# EAGLE design control_board-ATSAMD21 (EAGLE 8.3.1)
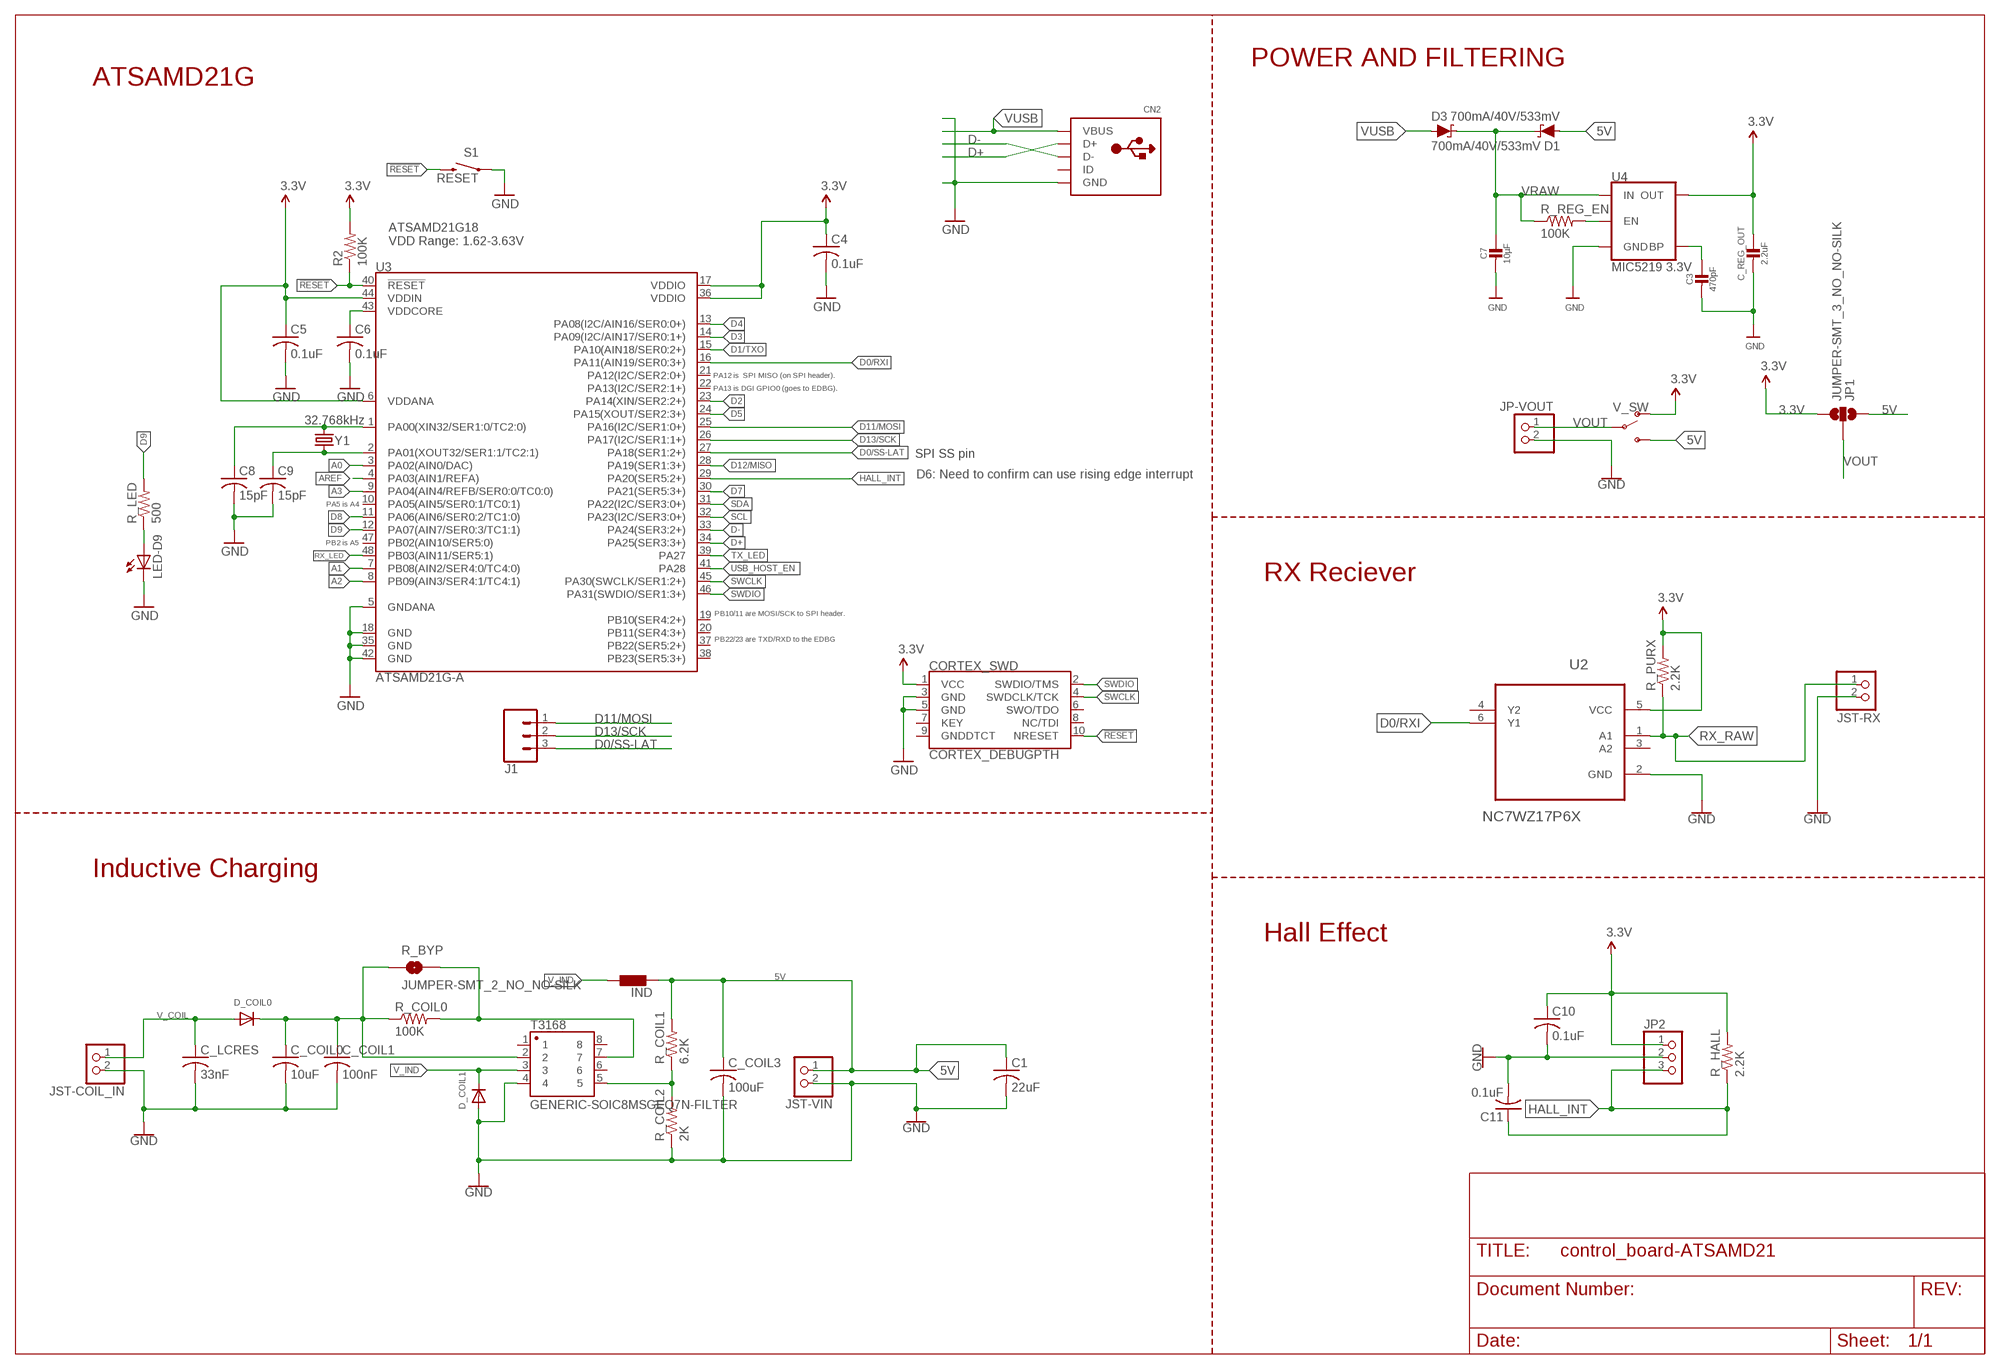
[diagram p0: schematic, sheet 1]

## Parts
C1  22uF  C-USC1206  [C1206]
C3  470pF  CAP_CERAMIC0603_NO  [0603-NO]
C4  0.1uF  C-USC0603  [C0603]
C5  0.1uF  C-USC0603  [C0603]
C6  0.1uF  C-USC0603  [C0603]
C7  10µF  CAP_CERAMIC0805-NOOUTLINE  [0805-NO]
C8  15pF  C-USC0603  [C0603]
C9  15pF  C-USC0603  [C0603]
C10  0.1uF  C-USC0603  [C0603]
C11  0.1uF  C-USC0603  [C0603]
C_COIL0  10uF  C-USC1206  [C1206]
C_COIL1  100nF  C-USC1206  [C1206]
C_COIL3  100uF  C-USC1206  [C1206]
C_LCRES  33nF  C-USC1206  [C1206]
C_REG_OUT  2.2uF  CAP_CERAMIC0805-NOOUTLINE  [0805-NO]
CN2  USBTHM  [USB-MINIB-THM]
CORTEX_SWD  CORTEX_DEBUGPTH  [2X5-PTH-1.27MM]
D1  700mA/40V/533mV  DIODE-SCHOTTKY-ZLLS500  [SOT23-3]
D3  700mA/40V/533mV  DIODE-SCHOTTKY-ZLLS500  [SOT23-3]
D_COIL0  DIODESMA  [SMADIODE]
D_COIL1  DIODE_SOD-123FL  [SOD-123FL]
IND  LL3230M  [L3230M]
J1  CONN_031X03_NO_SILK  [1X03_NO_SILK]
JP1  JUMPER-SMT_3_NO_NO-SILK  [SMT-JUMPER_3_NO_NO-SILK]
JP2  PINHD-1X3  [1X03]
JP-VOUT  PINHD-1X2  [1X02]
JST-COIL_IN  JST_2PIN-THM-RA  [JST-PH-2-THM-RA]
JST-RX  JST_2PIN-THM-RA  [JST-PH-2-THM-RA]
JST-VIN  JST_2PIN-THM-RA  [JST-PH-2-THM-RA]
LED-D9  LEDCHIPLED_0603  [CHIPLED_0603]
R2  100K  10KOHM-1/10W-1%(0603)0603  [0603-RES]
R_BYP  JUMPER-SMT_2_NO_NO-SILK  [SMT-JUMPER_2_NO_NO-SILK]
R_COIL0  100K  R-US_R0603  [R0603]
R_COIL1  6.2K  R-US_R0603  [R0603]
R_COIL2  2K  R-US_R0603  [R0603]
R_HALL  2.2K  R-US_R0805  [R0805]
R_LED  500  R-US_R0603  [R0603]
R_PURX  2.2K  R-US_R0603  [R0603]
R_REG_EN  100K  R-US_R0603  [R0603]
S1  RESET  SWITCH-MOMENTARY-2SMD-4.6X2.8MM  [TACTILE_SWITCH_SMD_4.6X2.8MM]
T3168  GENERIC-SOIC8MSGEQ7N-FILTER  [SO08]
U2  NC7WZ17P6X  [SOT65P210X110-6N]
U3  ATSAMD21G-A  [TQFP-48]
U4  MIC5219 3.3V  V_REG_MIC52193.3V  [SOT23-5]
V_SW  SWITCH-SPDT-SMD-RIGHT-ANGLE  [SWITCH_SPST_SMD_A]
Y1  32.768kHz  CRYSTAL3.2X1.5MM  [CRYSTAL-SMD-3.2X1.5MM]

## Nets
3.3V: C4.1 C5.1 C10.1 C_REG_OUT.1 CORTEX_SWD.1(VCC) JP1.3 JP2.1 R2.2 R_HALL.2 R_PURX.2 U2.5(VCC) U3.6(VDDANA) U3.17(VDDIO) U3.36(VDDIO) U3.44(VDDIN) U4.5(OUT) V_SW.1(O)
5V: C1.1 C_COIL3.1 D1.1(A) IND.2 JP1.1 JST-VIN.1 R_COIL1.2 V_SW.3(S)
!RESET: CORTEX_SWD.10(NRESET) R2.1 S1.3 S1.4 U3.40(!RESET!)
A0: U3.3(PA02(AIN0/DAC))
A1: U3.7(PB08(AIN2/SER4:0/TC4:0))
A2: U3.8(PB09(AIN3/SER4:1/TC4:1))
A3: U3.9(PA04(AIN4/REFB/SER0:0/TC0:0))
AREF: U3.4(PA03(AIN1/REFA))
D0/RXI: U2.6(Y1) U3.16(PA11(AIN19/SER0:3+))
D0/SS-LAT: J1.3 U3.27(PA18(SER1:2+))
D1/TXO: U3.15(PA10(AIN18/SER0:2+))
D2: U3.23(PA14(XIN/SER2:2+))
D3: U3.14(PA09(I2C/AIN17/SER0:1+))
D4: U3.13(PA08(I2C/AIN16/SER0:0+))
D5: U3.24(PA15(XOUT/SER2:3+))
D7: U3.30(PA21(SER5:3+))
D8: U3.11(PA06(AIN6/SER0:2/TC1:0))
D9: R_LED.2 U3.12(PA07(AIN7/SER0:3/TC1:1))
D11/MOSI: J1.1 U3.25(PA16(I2C/SER1:0+))
D12/MISO: U3.28(PA19(SER1:3+))
D13/SCK: J1.2 U3.26(PA17(I2C/SER1:1+))
D+: CN2.D+ U3.34(PA25(SER3:3+))
D-: CN2.D- U3.33(PA24(SER3:2+))
GND: C1.2 C3.2 C4.2 C5.2 C6.2 C7.2 C8.2 C9.2 C10.2 C11.2 C_COIL0.2 C_COIL1.2 C_COIL3.2 C_LCRES.2 C_REG_OUT.2 CN2.GND CORTEX_SWD.3(GND) CORTEX_SWD.5(GND) D_COIL1.A JP2.2 JP-VOUT.2 JST-COIL_IN.2 JST-RX.2 JST-VIN.2 LED-D9.C R_COIL2.1 S1.1 S1.2 T3168.4 U2.2(GND) U3.5(GNDANA) U3.18(GND) U3.35(GND) U3.42(GND) U4.2(GND)
HALL_INT: C11.1 JP2.3 R_HALL.1 U3.29(PA20(SER5:2+))
N$1: C_COIL0.1 C_COIL1.1 D_COIL0.C R_BYP.1 R_COIL0.1 T3168.2
N$2: C8.1 U3.1(PA00(XIN32/SER1:0/TC2:0)) Y1.P$2
N$3: R_COIL1.1 R_COIL2.2 T3168.5
N$4: C9.1 U3.2(PA01(XOUT32/SER1:1/TC2:1)) Y1.P$1
N$5: R_REG_EN.2 U4.3(EN)
N$6: C3.1 U4.4(BP)
N$7: R_BYP.2 R_COIL0.2 T3168.7
N$8: LED-D9.A R_LED.1
RX_LED: U3.48(PB03(AIN11/SER5:1))
RX_RAW: JST-RX.1 R_PURX.1 U2.1(A1)
SCL: U3.32(PA23(I2C/SER3:0+))
SDA: U3.31(PA22(I2C/SER3:0+))
SWCLK: CORTEX_SWD.4(SWDCLK/TCK) U3.45(PA30(SWCLK/SER1:2+))
SWDIO: CORTEX_SWD.2(SWDIO/TMS) U3.46(PA31(SWDIO/SER1:3+))
TX_LED: U3.39(PA27)
USB_HOST_EN: U3.41(PA28)
V_COIL: C_LCRES.1 D_COIL0.A JST-COIL_IN.1
V_IND: D_COIL1.C IND.1 T3168.3
VDDCORE: C6.1 U3.43(VDDCORE)
VOUT: JP1.2 JP-VOUT.1 V_SW.2(P)
VRAW: C7.1 D1.3(C) D3.3(C) R_REG_EN.1 U4.1(IN)
VUSB: CN2.VBUS D3.1(A)
Unconnected: CN2.ID CORTEX_SWD.6(SWO/TDO) CORTEX_SWD.7(KEY) CORTEX_SWD.8(NC/TDI) CORTEX_SWD.9(GNDDTCT) T3168.1 T3168.6 T3168.8 U2.3(A2) U2.4(Y2) U3.10(PA05(AIN5/SER0:1/TC0:1)) U3.19(PB10(SER4:2+)) U3.20(PB11(SER4:3+)) U3.21(PA12(I2C/SER2:0+)) U3.22(PA13(I2C/SER2:1+)) U3.37(PB22(SER5:2+)) U3.38(PB23(SER5:3+)) U3.47(PB02(AIN10/SER5:0))

## Notes on the sheet
- ATSAMD21G | POWER AND FILTERING
- ATSAMD21G18
  VDD Range: 1.62-3.63V
- PA12 is  SPI MISO (on SPI header).
- PA13 is DGI GPIO0 (goes to EDBG).
- SPI SS pin
- D6: Need to confirm can use rising edge interrupt
- PA5 is A4
- PB2 is A5
- RX Reciever
- PB10/11 are MOSI/SCK to SPI header.
- PB22/23 are TXD/RXD to the EDBG
- Inductive Charging
- Hall Effect

## Library data of the parts
C1 C4-C6 C8-C11 C_COIL0 C_COIL1 C_COIL3 C_LCRES = adafruit:C-US: CAPACITOR, American symbol
C3 C7 C_REG_OUT = microbuilder:CAP_CERAMIC: Ceramic Capacitors For new designs, use the packages preceded by an '_' character since they are more reliable: The following footprints should be used on most boards: _0402 - Standard footprint for regular board layouts _0603 - Standard footprint for regular board layouts _0805 - Standard footprint for regular board layouts _1206 - Standard footprint for regular board layouts For extremely tight-pitch boards where space is at a premium, the following 'micro-pitch' footprints can be used (smaller pads, no silkscreen outline, etc.): _0402MP - Micro-pitch footprint for very dense/compact boards _0603MP - Micro-pitch footprint for very dense/compact boards _0805MP - Micro-pitch footprint for very dense/compact boards _1206MP - Micro-pitch footprint for very dense/compact boards
CN2 = adafruit:USB: USB Connectors USBMINIB - Surface Mount Female Mini-B USB Connector 4UConnector: 06564 By microbuilder.eu Thru-hole RA Female Mini-B USB Connector 4UConnector: 18732 By ladyada.net
CORTEX_SWD = samd21-temp:CORTEX_DEBUG: Cortex Debug Connector Datasheet <http://infocenter.arm.com/help/topic/com.arm.doc.faqs/attached/13634/cortex_debug_connectors.pdf>
D1 D3 = SparkFun-DiscreteSemi:DIODE-SCHOTTKY: Schottky diode A Schottky diode is a semiconductor diode which has a low forward voltage drop and a very fast switching action.; PROD_ID: DIO-08411
D_COIL0 D_COIL1 = adafruit:DIODE: Diode SMADIODE - SMA Surface Mount Package 20V 1A Schottky Diode Digikey: 641-1014-6-ND DO-1N4148 - Through Hole Small Current Diode SOD-123 20V 1 A (.5mV Vf) Schottky Diode - Digikey: MBRX120TPMSCT-ND SOD-323 10V 570mA (.38mV Vf, 3ns) Schottky Diode - Digikey: ZLLS410CT-ND SOD-523 30V 30mA Schottky Diode (RB751S-40TE61) - Digikey: RB751S-40TE61CT-ND SOT23-R/W - SOT23 Package (R = Solder Paste/Reflow Ovens, W = Hand-Soldering) BAT54Film 40V 300mA - Digikey: 497-7162-1-ND
IND = eagle-ltspice:L: INDUCTOR, European symbol; SPICEMODEL: NONE; SPICEPREFIX: L
J1 = SparkFun-Connectors:CONN_03: Multi connection point. Often used as Generic Header-pin footprint for 0.1 inch spaced/style header connections On any of the 0.1 inch spaced packages, you can populate with these: Break Away Headers - Straight <https://www.sparkfun.com/products/116> (PRT-00116) Break Away Male Headers - Right Angle <https://www.sparkfun.com/products/553> (PRT-00553) Female Headers <https://www.sparkfun.com/products/115> (PRT-00115) Break Away Headers - Machine Pin <https://www.sparkfun.com/products/117> (PRT-00117) Break Away Female Headers - Swiss Machine Pin <https://www.sparkfun.com/products/743> (PRT-00743) Stackable Header - 3 Pin (Female, 0.1") <https://www.sparkfun.com/products/13875> (PRT-13875) For SCREWTERMINALS and SPRING TERMINALS visit here: Screw Terimnals on SparkFun.com <https://www.sparkfun.com/search/results?term=Screw+Terminals> (5mm/3.5mm/2.54mm spacing) This device is also useful as a general connection point to wire up your design to another part of your project. Our various solder wires solder well into these plated through hole pads. Hook-Up Wire - Assortment (Stranded, 22 AWG) <https://www.sparkfun.com/products/11375> (PRT-11375) Hook-Up Wire - Assortment (Solid Core, 22 AWG) <https://www.sparkfun.com/products/11367> (PRT-11367) View the entire wire category on our website here <https://www.sparkfun.com/categories/141> Special notes: Molex polarized connector foot print use with SKU : PRT-08232 with associated crimp pins and housings.
JP1 = SparkFun-Jumpers:JUMPER-SMT_3_NO: Normally open jumper This jumper has three pads in close proximity to each other. Apply solder to close the connection(s).
JP2 = pinhead:PINHD-1X3: PIN HEADER
JP-VOUT = pinhead:PINHD-1X2: PIN HEADER
JST-COIL_IN JST-RX JST-VIN = adafruit:JST_2PIN: JST 2-Pin Connectors of various flavors SMT-RA (S2B-PH-SM4) 4UConnector #17311 SMT (B2B-PH-SM4) THM-RA (S2B-PH) THM (B2B-PH)
LED-D9 = adafruit:LED: LED OSRAM: - CHIPLED LG R971, LG N971, LY N971, LG Q971, LY Q971, LO R971, LY R971 LH N974, LH R974 LS Q976, LO Q976, LY Q976 LO Q996 - Hyper CHIPLED LW Q18S LB Q993, LB Q99A, LB R99A - SideLED LS A670, LO A670, LY A670, LG A670, LP A670 LB A673, LV A673, LT A673, LW A673 LH A674 LY A675 LS A676, LA A676, LO A676, LY A676, LW A676 LS A679, LY A679, LG A679 - Hyper Micro SIDELED® LS Y876, LA Y876, LO Y876, LY Y876 LT Y87S - SmartLED LW L88C, LW L88S LB L89C, LB L89S, LG L890 LS L89K, LO L89K, LY L89K LS L896, LA L896, LO L896, LY L896 - TOPLED LS T670, LO T670, LY T670, LG T670, LP T670 LSG T670, LSP T670, LSY T670, LOP T670, LYG T670 LG T671, LOG T671, LSG T671 LB T673, LV T673, LT T673, LW T673 LH T674 LS T676, LA T676, LO T676, LY T676, LB T676, LH T676, LSB T676, LW T676 LB T67C, LV T67C, LT T67C, LS T67K, LO T67K, LY T67K, LW E67C LS E67B, LA E67B, LO E67B, LY E67B, LB E67C, LV E67C, LT E67C LW T67C LS T679, LY T679, LG T679 LS T770, LO T770, LY T770, LG T770, LP T770 LB T773, LV T773, LT T773, LW T773 LH T774 LS E675, LA E675, LY E675, LS T675 LS T776, LA T776, LO T776, LY T776, LB T776 LHGB T686 LT T68C, LB T68C - Hyper Mini TOPLED® LB M676 - Mini TOPLED Santana® LG M470 LS M47K, LO M47K, LY M47K Source: http://www.osram.convergy.de/
R2 = SparkFun-Resistors:10KOHM-1/10W-1%(0603): RES-00824; PROD_ID: RES-00824; VALUE: 10K
R_BYP = SparkFun-Jumpers:JUMPER-SMT_2_NO: Normally open jumper This jumper has two pads in close proximity to each other. Apply solder to close the connection. Round pads are easier to solder for beginners, but are a lot larger. SparkFun Product that uses the round pads: SparkFun EL Sequencer <https://www.sparkfun.com/products/12781>
R_COIL0 R_COIL1 R_COIL2 R_HALL R_LED R_PURX R_REG_EN = adafruit:R-US_: RESISTOR, American symbol
S1 = samd21-temp:SWITCH-MOMENTARY-2: Various NO switches- pushbuttons, reed, etc; PROD_ID: SWCH-13065
T3168 = SparkFun-Retired:GENERIC-SOIC8: A placeholder for generic narrow & wide SOIC8 foorptints - used on the DIP adapter board. Has strange reference to IC-10141, a Seven Band Graphic Equalizer Display Filter SOIC-8 VFP: IC-10141; PROD_ID: IC-10141
U2 = NC7WZ17P6X:NC7WZ17P6X: Dual Buffer; AVAILABILITY: Good; DESCRIPTION: NC7WZ17 Series 5.5 V TinyLogic UHS Dual Buffer w/ Schmitt Trigger Inputs-SC-70-6; MF: Fairchild Semiconductor; MP: NC7WZ17P6X; PACKAGE: SC-70-6 Fairchild Semiconductor; PRICE: 0.10 USD
U3 = samd21-temp:ATSAMD21G: Atmel SAMD21G SMART ARM-Based Microcontroller The Atmel ® | SMART ™ SAM D21 is a series of low-power microcontrollers using the 32-bit ARM ® Cortex ® -M0+ processor, and ranging from 32- to 64-pins with up to 256KB Flash and 32KB of SRAM. The SAM D21 devices operate at a maximum frequency of 48MHz and reach 2.46 CoreMark/MHz. They are designed for simple and intuitive migration with identical peripheral modules, hex compatible code, identical linear address map and pin compatible migration paths between all devices in the product series. All devices include intelligent and flexible peripherals, Atmel Event System for inter-peripheral signaling, and support for capacitive touch button, slider and wheel user interfaces.; PROD_ID: IC-13064
U4 = SparkFun-IC-Power:V_REG_MIC5219: V_REG MIC5219 Standard 3.3V and 5V 500mA LDO voltage regulator in SOT-23 layout. Micrel part MIC5219. BP (by-pass) pin is used to lower output noise with 470pF cap, may be left open.; PROD_ID: VREG-09872
V_SW = SparkFun-Switches:SWITCH-SPDT: Single Pole, Double Throw (SPDT) Switch Single-pole, double-throw (SPDT) switch. Variant Overview SMD-AYZ0202 Surface Mount DPDT Switch <https://www.sparkfun.com/products/597> (COM-00597) Used on e.g. LilyPad Arduino USB - ATmega32U4 Board <https://www.sparkfun.com/products/12049> PTH-11.6X4.0MM SPDT Mini Power Switch <https://www.sparkfun.com/products/102> (COM-00102) Used on e.g. SparkFun Simon Says - Through-Hole Soldering Kit <https://www.sparkfun.com/products/10547> (KIT-10547) PTH-11.6X4.0MM-KIT KIT version of SPDT Mini Power Switch - Simplifies soldering by removing tStop of switch pins - only one side can be soldered. PTH-11.6X4.0MM-LOCK LOCK version of SPDT Mini Power Switch - Offset pins hold switch in place for easier soldering. SMD-RIGHT-ANGLE Surface Mount Right Angle Switch <https://www.sparkfun.com/products/10860> (COM-10860) Used on e.g. SparkFun ESP8266 Thing <https://www.sparkfun.com/products/13231>; PROD_ID: SWCH-10651; SF_SKU: COM-10860
Y1 = samd21-temp:CRYSTAL: Various standard crystals. Proven footprints.; PROD_ID: XTAL-13062

## Board
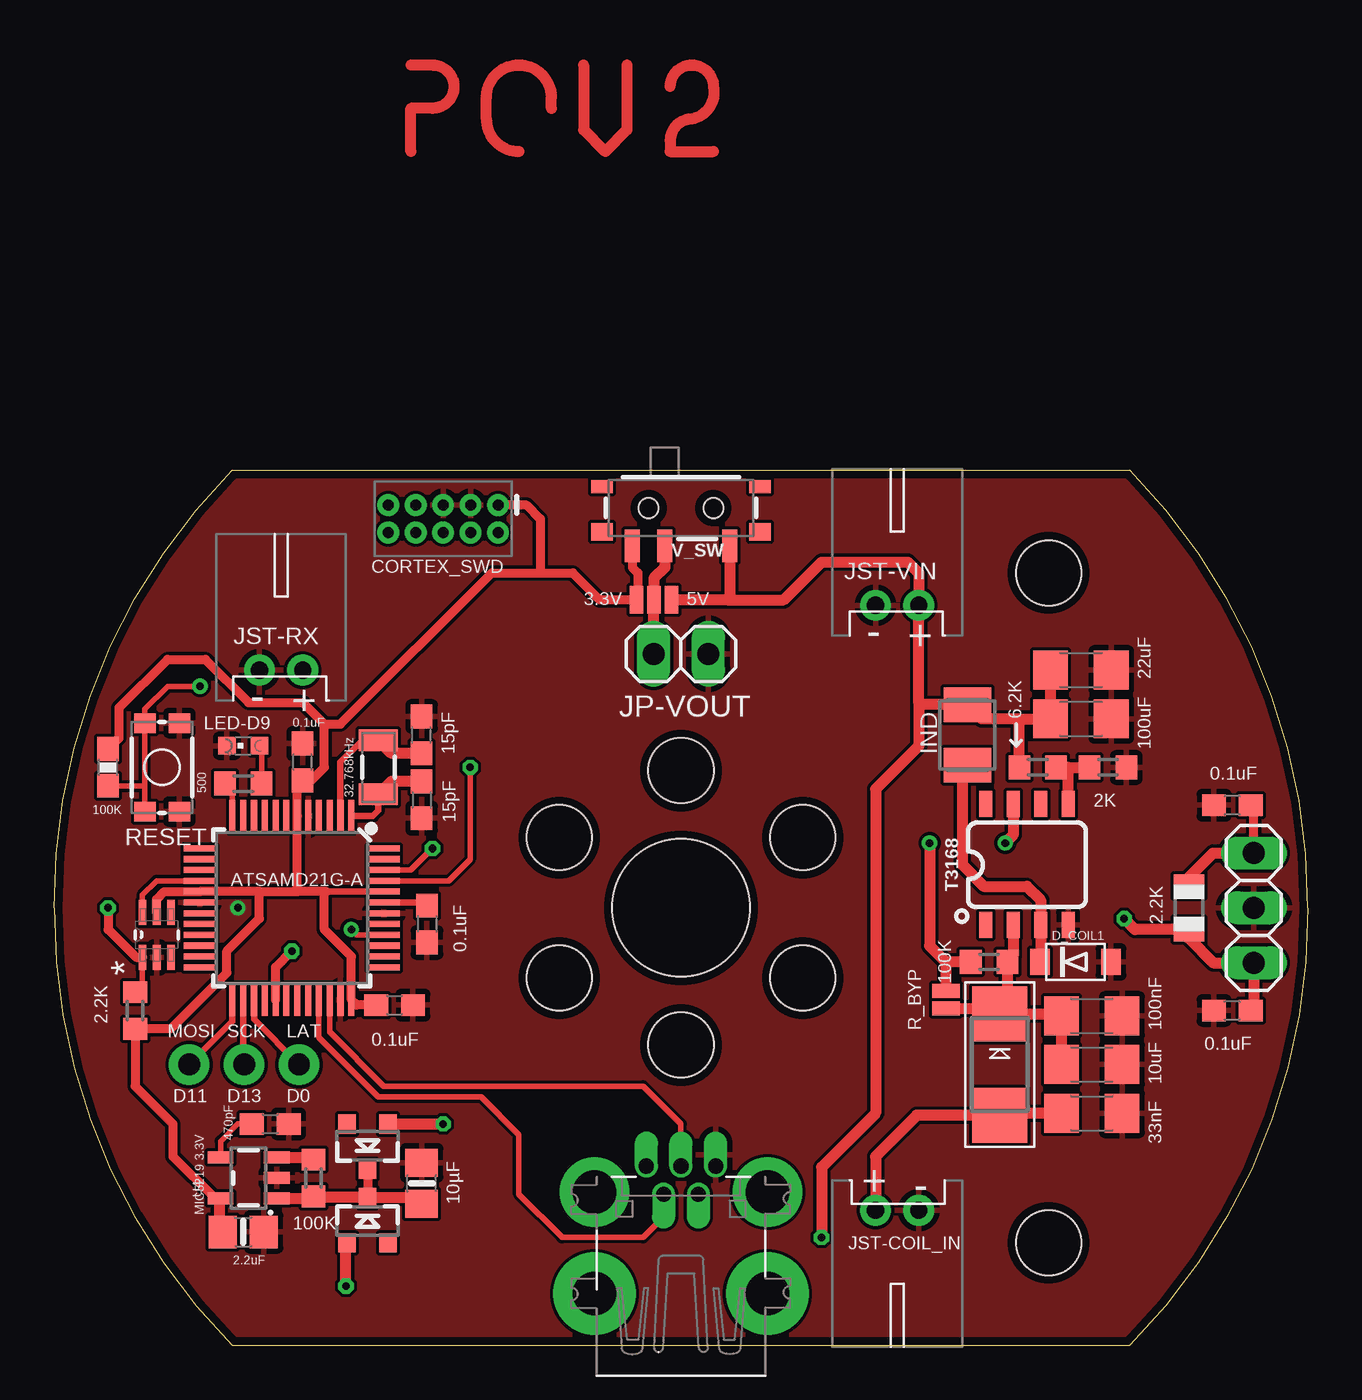
[diagram p1: board, top side]
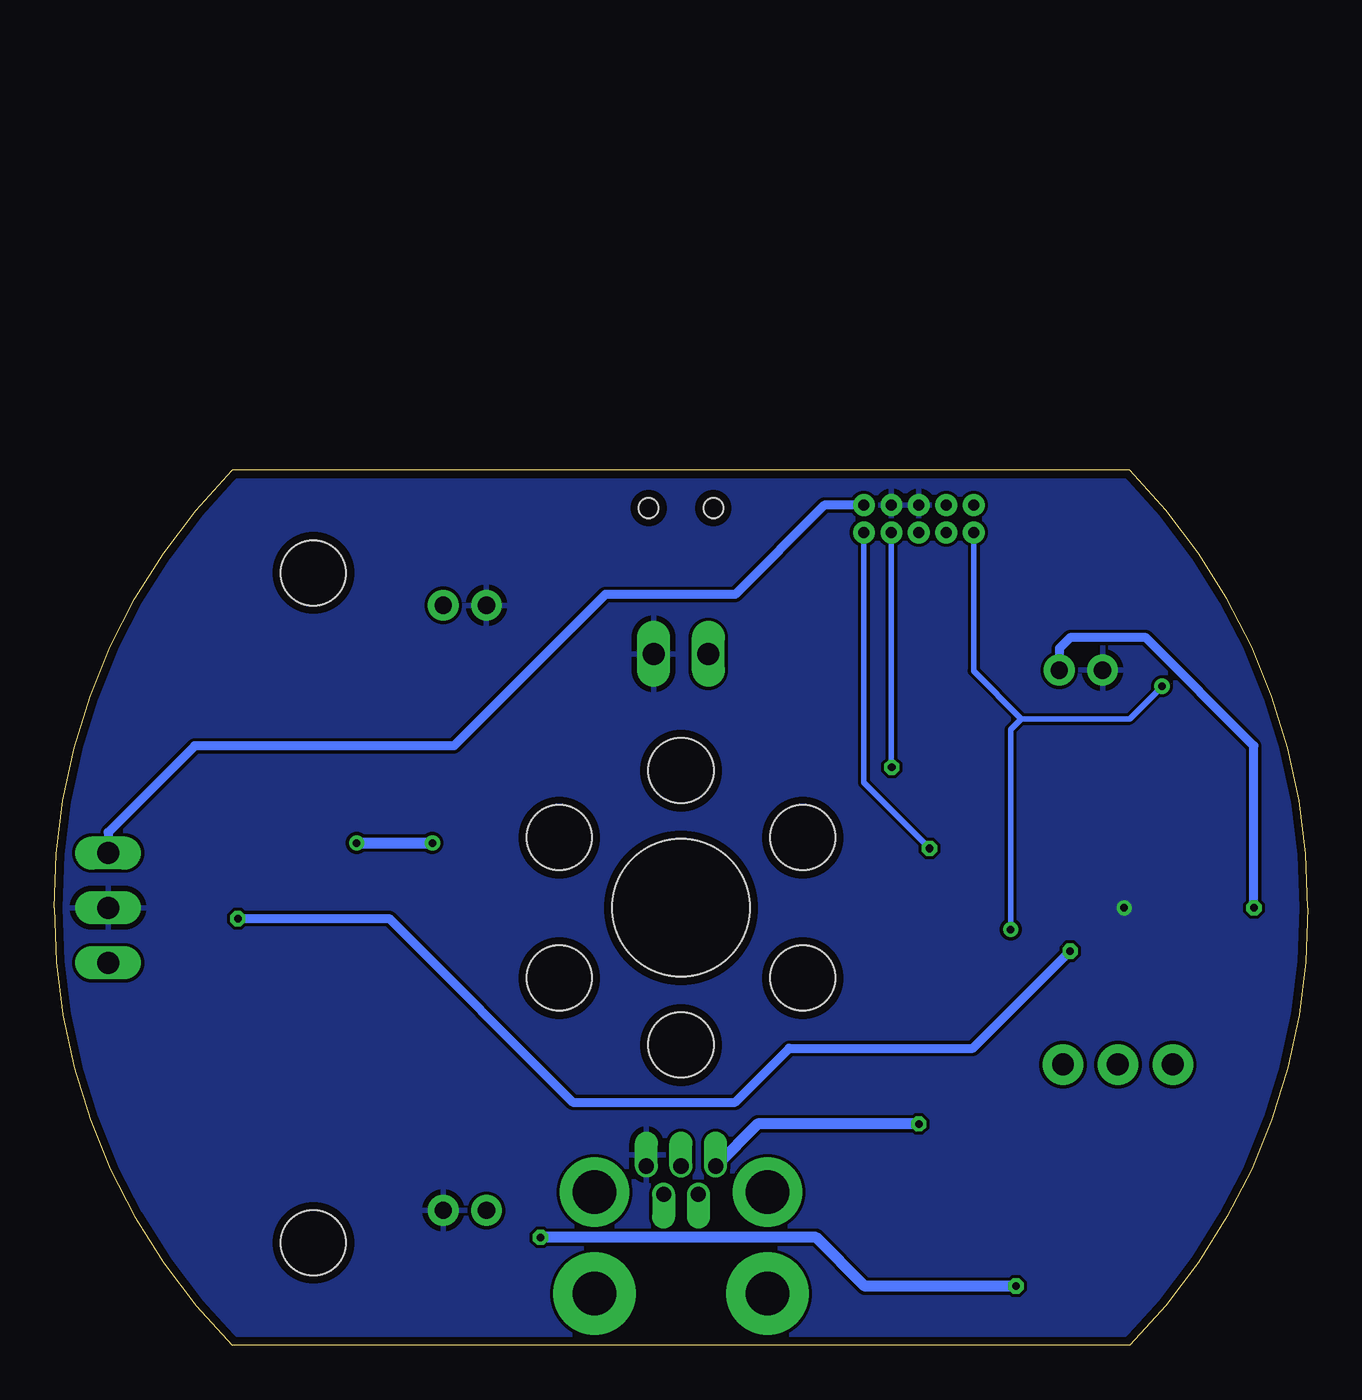
[diagram p2: board, bottom side, seen from below]

Size 58 x 40.5 mm. Coordinates in mm from the lower left corner, seen from the top.
Outline: 8.25,0 49.75,0 arc45 58,20.25 arc45 49.75,40.5 8.25,40.5 arc45 0,20.25 arc45 8.25,0
Copper layers (1*16): Top 0.0356mm / dielectric 1.5011mm / Bottom 0.0356mm
Design rules "LaenPCBOrder": minimum track width 6mil, minimum drill 13mil, track to track 6mil, track to pad 6mil, pad to pad 6mil, via to via 6mil, smd to smd 6mil, copper to edge 15mil, drill to drill 6mil, minimum pad ring 7mil, minimum via ring 7mil, stop-mask expansion 3mil, vias tented up to drill 0mil, thermal gap 10mil
Holes 6.35 mm at 29,20.25
Holes 3 mm at 29,26.6 34.63,17 23.37,17 46,35.75 46,4.75 29,13.9 23.37,23.5 34.63,23.5

### Footprints (pad centres in the part's own frame; a part is rotated, then mirrored left to right if it is on the bottom)
C1206 = smd 1.6 x 1.8: 1 -1.4,0; 2 1.4,0
0603-NO = smd 1.1 x 1: 1 -0.85,0; 2 0.85,0
C0603 = smd 1.1 x 1: 1 -0.85,0; 2 0.85,0
0805-NO = smd 1.3 x 1.5: 1 -0.95,0; 2 0.95,0
USB-MINIB-THM = drill 0.7 offset: D+ 0,9.8; D- -0.8,8.5; GND 1.6,9.8; ID 0.8,8.5; VBUS -1.6,9.8 | drill 2 pad 3.81: GND1 -4,3.9; GND4 4,3.9 | drill 2 pad 3.2: GND2 -4,8.6; GND3 4,8.6
2X5-PTH-1.27MM = drill 0.508 pad 1: 1 -2.54,-0.635; 2 -2.54,0.635; 3 -1.27,-0.635; 4 -1.27,0.635; 5 0,-0.635; 6 0,0.635; 7 1.27,-0.635; 8 1.27,0.635; 9 2.54,-0.635; 10 2.54,0.635
SOT23-3 = smd 0.8 x 0.9: 1 -0.95,-1; 2 0.95,-1; 3 0,1.1
SMADIODE = smd 2.54 x 2.54: A 2.349,0; C -2.349,0
SOD-123FL = smd 0.91 x 1.22: A 1.637,0; C -1.637,0
L3230M = smd 1.6 x 2.2: 1 -1.4,0; 2 1.4,0
1X03_NO_SILK = drill 1.016 pad 1.88: 1 0,0; 2 2.54,0; 3 5.08,0
SMT-JUMPER_3_NO_NO-SILK = smd 0.635 x 1.27: 1 -0.813,0; 2 0,0; 3 0.813,0
1X03 = drill 1.016 long: 1 -2.54,0; 2 0,0; 3 2.54,0
1X02 = drill 1.016 long: 1 -1.27,0; 2 1.27,0
JST-PH-2-THM-RA = drill 0.8 pad 1.422: 1 1,0; 2 -1,0
CHIPLED_0603 = smd 0.8 x 0.8: A 0,-0.75; C 0,0.75
0603-RES = smd 1.1 x 1: 1 -0.85,0; 2 0.85,0
SMT-JUMPER_2_NO_NO-SILK = smd 0.635 x 1.27: 1 -0.406,0; 2 0.406,0
R0603 = smd 1 x 1.1: 1 -0.85,0; 2 0.85,0
R0805 = smd 1.1 x 1.4: 1 -1,0; 2 1,0
TACTILE_SWITCH_SMD_4.6X2.8MM = smd 0.9 x 1: 1 -2.05,-0.8; 2 2.05,-0.8; 3 2.05,0.8; 4 -2.05,0.8
SO08 = smd 0.6 x 1.2: 1 -1.905,-2.8; 2 -0.635,-2.8; 3 0.635,-2.8; 4 1.905,-2.8; 5 1.905,2.8; 6 0.635,2.8; 7 -0.635,2.8; 8 -1.905,2.8
SOT65P210X110-6N = smd 1.168 x 0.356: 1 -1.041,0.66; 2 -1.041,0; 3 -1.041,-0.66; 4 1.041,-0.66; 5 1.041,0; 6 1.041,0.66
TQFP-48 = smd 1.5 x 0.28: 1 -4.25,2.75; 2 -4.25,2.25; 3 -4.25,1.75; 4 -4.25,1.25; 5 -4.25,0.75; 6 -4.25,0.25; 7 -4.25,-0.25; 8 -4.25,-0.75; 9 -4.25,-1.25; 10 -4.25,-1.75; 11 -4.25,-2.25; 12 -4.25,-2.75; 25 4.25,-2.75; 26 4.25,-2.25; 27 4.25,-1.75; 28 4.25,-1.25; 29 4.25,-0.75; 30 4.25,-0.25; 31 4.25,0.25; 32 4.25,0.75; 33 4.25,1.25; 34 4.25,1.75; 35 4.25,2.25; 36 4.25,2.75 | smd 0.28 x 1.5: 13 -2.75,-4.25; 14 -2.25,-4.25; 15 -1.75,-4.25; 16 -1.25,-4.25; 17 -0.75,-4.25; 18 -0.25,-4.25; 19 0.25,-4.25; 20 0.75,-4.25; 21 1.25,-4.25; 22 1.75,-4.25; 23 2.25,-4.25; 24 2.75,-4.25; 37 2.75,4.25; 38 2.25,4.25; 39 1.75,4.25; 40 1.25,4.25; 41 0.75,4.25; 42 0.25,4.25; 43 -0.25,4.25; 44 -0.75,4.25; 45 -1.25,4.25; 46 -1.75,4.25; 47 -2.25,4.25; 48 -2.75,4.25
SOT23-5 = smd 0.55 x 1.2: 1 -0.95,-1.3; 2 0,-1.3; 3 0.95,-1.3; 4 0.95,1.3; 5 -0.95,1.3
SWITCH_SPST_SMD_A = smd 0.7 x 1.5: 1 -2.25,-1.75; 2 -0.75,-1.75; 3 2.25,-1.75 | smd 1 x 0.6: GND1 -3.65,1; GND3 3.65,1 | smd 1 x 0.8: GND2 -3.65,-1.1; GND4 3.65,-1.1 | hole 0.9: -1.5,0; 1.5,0
CRYSTAL-SMD-3.2X1.5MM = smd 1 x 1.8: P$1 -1.25,0; P$2 1.25,0

### Placement (x,y rotation side)
C1  47.5,31.25 0 top
C3  10,10.25 0 top
C4  15.75,15.75 0 top
C5  11.5,27 90 top
C6  17.25,19.5 270 top
C7  17,7.5 90 top
C8  17,25.25 270 top
C9  17,28.25 90 top
C10  54.5,25 180 top
C11  54.5,15.5 180 top
C_COIL0  48,13 0 top
C_COIL1  48,15.25 0 top
C_COIL3  47.5,29 0 top
C_LCRES  48,10.75 0 top
C_REG_OUT  8.75,5.25 0 top
CN2  29,-1.5 0 top
CORTEX_SWD  18,38.25 180 top
D1  14.5,5.75 0 top
D3  14.5,9.25 180 top
D_COIL0  43.75,13 270 top
D_COIL1  47.25,17.75 0 top
IND  42.25,28.25 90 top
J1  6.25,13 0 top
JP1  27.75,34.5 180 top
JP2  55.5,20.25 270 top
JP-VOUT  29,32 0 top
JST-COIL_IN  39,6.25 180 top
JST-RX  10.5,31.25 0 top
JST-VIN  39,34.25 0 top
LED-D9  8.75,27.75 90 top
R2  2.5,26.75 90 top
R_BYP  41.25,16 90 top
R_COIL0  43.25,17.75 180 top
R_COIL1  45.5,26.75 180 top
R_COIL2  48.75,26.75 180 top
R_HALL  52.5,20.25 90 top
R_LED  8.75,26 180 top
R_PURX  3.75,15.5 270 top
R_REG_EN  12,7.75 90 top
S1  5,26.75 90 top
T3168  45,22.25 0 top
U2  4.75,19 90 top
U3  11,20.25 270 top
U4  9,7.75 90 top
V_SW  29,38.75 0 top
Y1  15,26.75 270 top

### Tracks (layer width: path | path; a pad name or v marks a point on that pad's centre or on a via)
2
  Top 0.508: 28.5,58.25 arc-90 29.5,59.25 arc-90 30.5,58.25 arc-90 29.5,56.75 arc90 28.5,55.75 28.5,55.25 30.5,55.25
3.3V
  Top 0.305: U3.44 12.6,21
  Top 0.406: U2.5 4.75,20.65 5.1,21 U3.17 9.54,21 | 9.54,21 11.24,21 | 9.54,21 9.5,20.96 9.5,19.75 8,18.25 8,17.25 5.4,14.65 R_PURX.2 3.75,12 5.5,10.25 5.5,8.75 7.45,6.8 U4.5 7.65,6.75 | 11.24,21 12.6,21 12.5,20.9 12.5,19.25 13.75,18 U3.36 14,15.75 C4.1 | 11.24,21 11.25,21.01 U3.6 11.25,25.9 C5.1 11.9,26.15 12.5,26.75 12.5,28.75 | 22.48,35.75 24,35.75 25.25,34.5 JP1.3 27,34.56 27,35.75 26.75,36 V_SW.1 | CORTEX_SWD.1 21.87,38.89 22.5,38.25 22.5,35.77 22.48,35.75 | JP2.1 55.5,24.85 C10.1 | R2.2 3,28.1 3,29.5 5.25,31.75 7,31.75 9,29.75 11.5,29.75 12.5,28.75 | 12.5,28.75 13.25,28.75 20.25,35.75 22.48,35.75
  Top 0.508: JP2.1 53.62,22.79 52.5,21.67 R_HALL.2 | 7.65,6.75 7.65,5.4 C_REG_OUT.1
  Bottom 0.406: JP2.1 55.5,23.75 51.5,27.75 39.5,27.75 32.5,34.75 26.5,34.75 22.37,38.89 CORTEX_SWD.1
5V  (via drill 0.35)
  Top 0.508: v13.5,2.75 13.5,4.7 D1.1 | v35.5,5 35.5,8.25 38,10.75 38,25.75 40,27.75 40,29.7 | 44.67,29 C_COIL3.1 C1.1 | 44.67,29 42.9,29 IND.2 40.05,29.65 40,29.7 | R_COIL1.2 44.65,28.98 44.67,29 | 31.13,34.5 JP1.1 | 31.13,34.5 33.75,34.5 35.5,36.25 39.5,36.25 40,35.75 JST-VIN.1 40,29.7 | V_SW.3 31.25,34.62 31.13,34.5
  Bottom 0.508: v35.5,5 22.75,5 20.5,2.75 v13.5,2.75
!RESET  (via drill 0.35)
  Top 0.254: 4.2,25.96 S1.3 | 4.2,25.96 S1.4 | R2.1 4.14,25.9 4.2,25.96 | U3.40 14,19 v13.75,19.25 | 4.25,28.85 S1.3 | v6.75,30.5 5.25,30.5 4.2,29.45 S1.3
  Bottom 0.254: v13.75,19.25 13.75,28.5 13.25,29 | 13.25,29 8.25,29 v6.75,30.5 | 13.25,29 15.46,31.21 CORTEX_SWD.10
D0/RXI
  Top 0.254: U2.6 4.09,20.84 4.75,21.5 U3.16
D0/SS-LAT
  Top 0.305: U3.27 9.25,15.08 J1.3
D9
  Top 0.254: U3.12 8.25,25.65 R_LED.2
D11/MOSI
  Top 0.305: U3.25 8.25,15 J1.1
D13/SCK
  Top 0.305: U3.26 8.75,13.04 J1.2
D+
  Top 0.254: U3.34 12.75,14.5 15.25,12 27.25,12 29,10.25 CN2.D+
D-
  Top 0.254: U3.33 12.25,14.25 15,11.5 19.75,11.5 21.5,9.75 21.5,7 23.5,5 27.25,5 28.2,5.95 CN2.D-
GND  (via drill 0.35)
  other vias: 8.5,20.25
  pour Top: -5.5,43.25 66.5,43.25 66.5,-3.25 -6,-3.25 -6,43.25
  pour Bottom: -9,51.25 73.5,51.25 73.5,-8.25 -9,-8.25
HALL_INT  (via drill 0.35)
  Top 0.406: U3.29 10.25,17.5 v11,18.25
  Top 0.508: v49.5,19.75 50,19.25 R_HALL.1 52.5,18.83 53.62,17.71 JP2.3 55.5,15.65 C11.1
  Bottom 0.406: v49.5,19.75 42.5,19.75 34,11.25 26.5,11.25 24,13.75 15.5,13.75 v11,18.25
N$1
  Top 0.508: T3168.2 44.37,18.02 R_COIL0.1 44.1,15.7 D_COIL0.C | D_COIL0.C 46.5,15.35 C_COIL1.1 C_COIL0.1 | R_BYP.1 43.51,15.59 D_COIL0.C
N$2
  Top 0.305: U3.1 14.75,24.5 15,24.75 Y1.P$2
  Top 0.508: C8.1 15.6,26.1 Y1.P$2
N$3
  Top 0.508: 46.89,26.75 R_COIL1.1 | 46.89,26.75 R_COIL2.2 | T3168.5 46.91,26.74 46.89,26.75
N$4
  Top 0.305: U3.2 13.25,27 14.25,28 Y1.P$1
  Top 0.508: C9.1 15.6,27.4 Y1.P$1
N$5
  Top 0.508: U4.3 11.9,8.7 R_REG_EN.2
N$6
  Top 0.254: U4.4 7.7,9.45 8.5,10.25 C3.1
N$7  (via drill 0.35)
  Top 0.508: T3168.7 44.37,23.62 v44,23.25 | 41.25,17.75 40.5,18.5 v40.5,23.25 | 41.25,17.75 R_BYP.2 | R_COIL0.2 41.25,17.75
  Bottom 0.508: v44,23.25 v40.5,23.25
N$8
  Top 0.254: R_LED.1 9.6,27.65 LED-D9.A
O
  Top 0.508: 23,57.25 23,57.75 arc90 21.5,59.25 arc90 20,57.75 20,56.75 arc90 21.5,55.25
P
  Top 0.508: 16.5,55.25 16.5,57.25 17.5,57.25 arc90 18.5,58.25 arc90 17.5,59.25 16.5,59.25
RX_RAW  (via drill 0.35)
  Top 0.254: U2.1 4.09,16.69 R_PURX.1
  Top 0.406: U2.1 3.79,17.96 2.5,19.25 v2.5,20.25
  Bottom 0.406: JST-RX.1 11.5,32.25 11,32.75 7.5,32.75 2.5,27.75 v2.5,20.25
SWCLK  (via drill 0.35)
  Top 0.254: U3.45 18.25,21.5 19.25,22.5 v19.25,26.75
  Bottom 0.254: v19.25,26.75 19.27,26.77 CORTEX_SWD.4
SWDIO  (via drill 0.35)
  Top 0.254: U3.46 16.5,22 v17.5,23
  Bottom 0.254: v17.5,23 20.54,26.04 CORTEX_SWD.2
V
  Top 0.508: 24.5,59.25 24.5,56.25 25.5,55.25 26.5,56.25 26.5,59.25
V_COIL
  Top 0.508: JST-COIL_IN.1 38,8.75 39.9,10.65 D_COIL0.A 43.85,10.75 C_LCRES.1
V_IND
  Top 0.508: IND.1 42.25,26.5 42,26.25 42,22.25 43,21.25 45,21.25 45.64,20.61 T3168.3 45.64,17.77 D_COIL1.C
VDDCORE
  Top 0.305: U3.43 17.1,20.5 C6.1
VOUT
  Top 0.508: JP-VOUT.1 27.75,32.02 JP1.2 27.75,35.5 28.25,36 V_SW.2
VRAW
  Top 0.406: D3.3 D1.3
  Top 0.508: C7.1 16.7,6.85 D1.3 12.05,6.85 R_REG_EN.1 11.9,6.8 U4.1
VUSB  (via drill 0.35)
  Top 0.508: D3.1 v18,10.25
  Bottom 0.508: CN2.VBUS 25.45,10.25 v18,10.25

### Text on the board
tPlace: 3.3V | 5V | MOSI | SCK | LAT | D11 | D13 | D0